# Altium schematic sheet 1.47 LCD .SchDoc
size A4; SheetNumber: 1; SheetTotal: 1
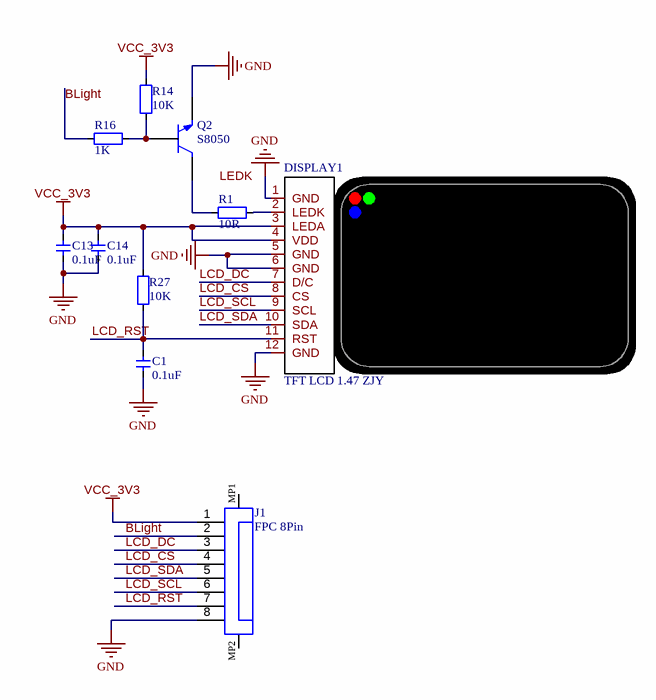
[diagram p0: 1.47 LCD .SchDoc]

## Parts
C1  0.1uF  [CAP_0402]
C13  0.1uF  [CAP_0402]
C14  0.1uF  [CAP_0402]
DISPLAY1  TFT LCD 1.47 ZJY  [ZJY 1.47‘’ TFT LCD]
J1  FPC 8Pin  [FPC 0.5MM 8P 1.0H]
Q2  S8050  [SOT23-3]
R1  10R  [RES_0402]
R14  10K  [RES_0402]
R16  1K  [RES_0402]
R27  10K  [RES_0402]

## Nets
GND: C1.1 C13.1 C14.1 DISPLAY1.1(GND) DISPLAY1.5(GND) DISPLAY1.6(GND) DISPLAY1.12(GND) J1.8 Q2.2(E)
VCC_3V3: C13.2 C14.2 DISPLAY1.3(LEDA) DISPLAY1.4(VDD) J1.1 R14.1 R27.2
BLight: J1.2 R16.1
LCD_CS: DISPLAY1.8(CS) J1.4
LCD_DC: DISPLAY1.7(D/C) J1.3
LCD_RST: C1.2 DISPLAY1.11(RST) J1.7 R27.1
LCD_SCL: DISPLAY1.9(SCL) J1.6
LCD_SDA: DISPLAY1.10(SDA) J1.5
NetDISPLAY1_2: DISPLAY1.2(LEDK) R1.2
NetQ2_1: Q2.1(B) R14.2 R16.2
NetQ2_3: Q2.3(C) R1.1

Not connected (* = marked no-connect by the designer): J1 MP1 MP2

## Notes on the sheet
- Labels drawn without touching a wire or pin: LEDK
- Titile:
- Drawn by:
- Class:
- Revision:
- Size:
- Date:

## Library data of the parts
C1 C13 C14 = 电容-0402: Capacitor; Value: 0.1u
DISPLAY1 = TFT LCD 1.47 ZJY: 中景园1.47屏幕
Q2 = S8050: NPN
R1 R14 R16 R27 = 电阻-0402: Resistor; Value: 22R